# Altium schematic sheet isg_adc_dac_test_board_top.SchDoc
size C; SheetNumber: 1; SheetTotal: 1
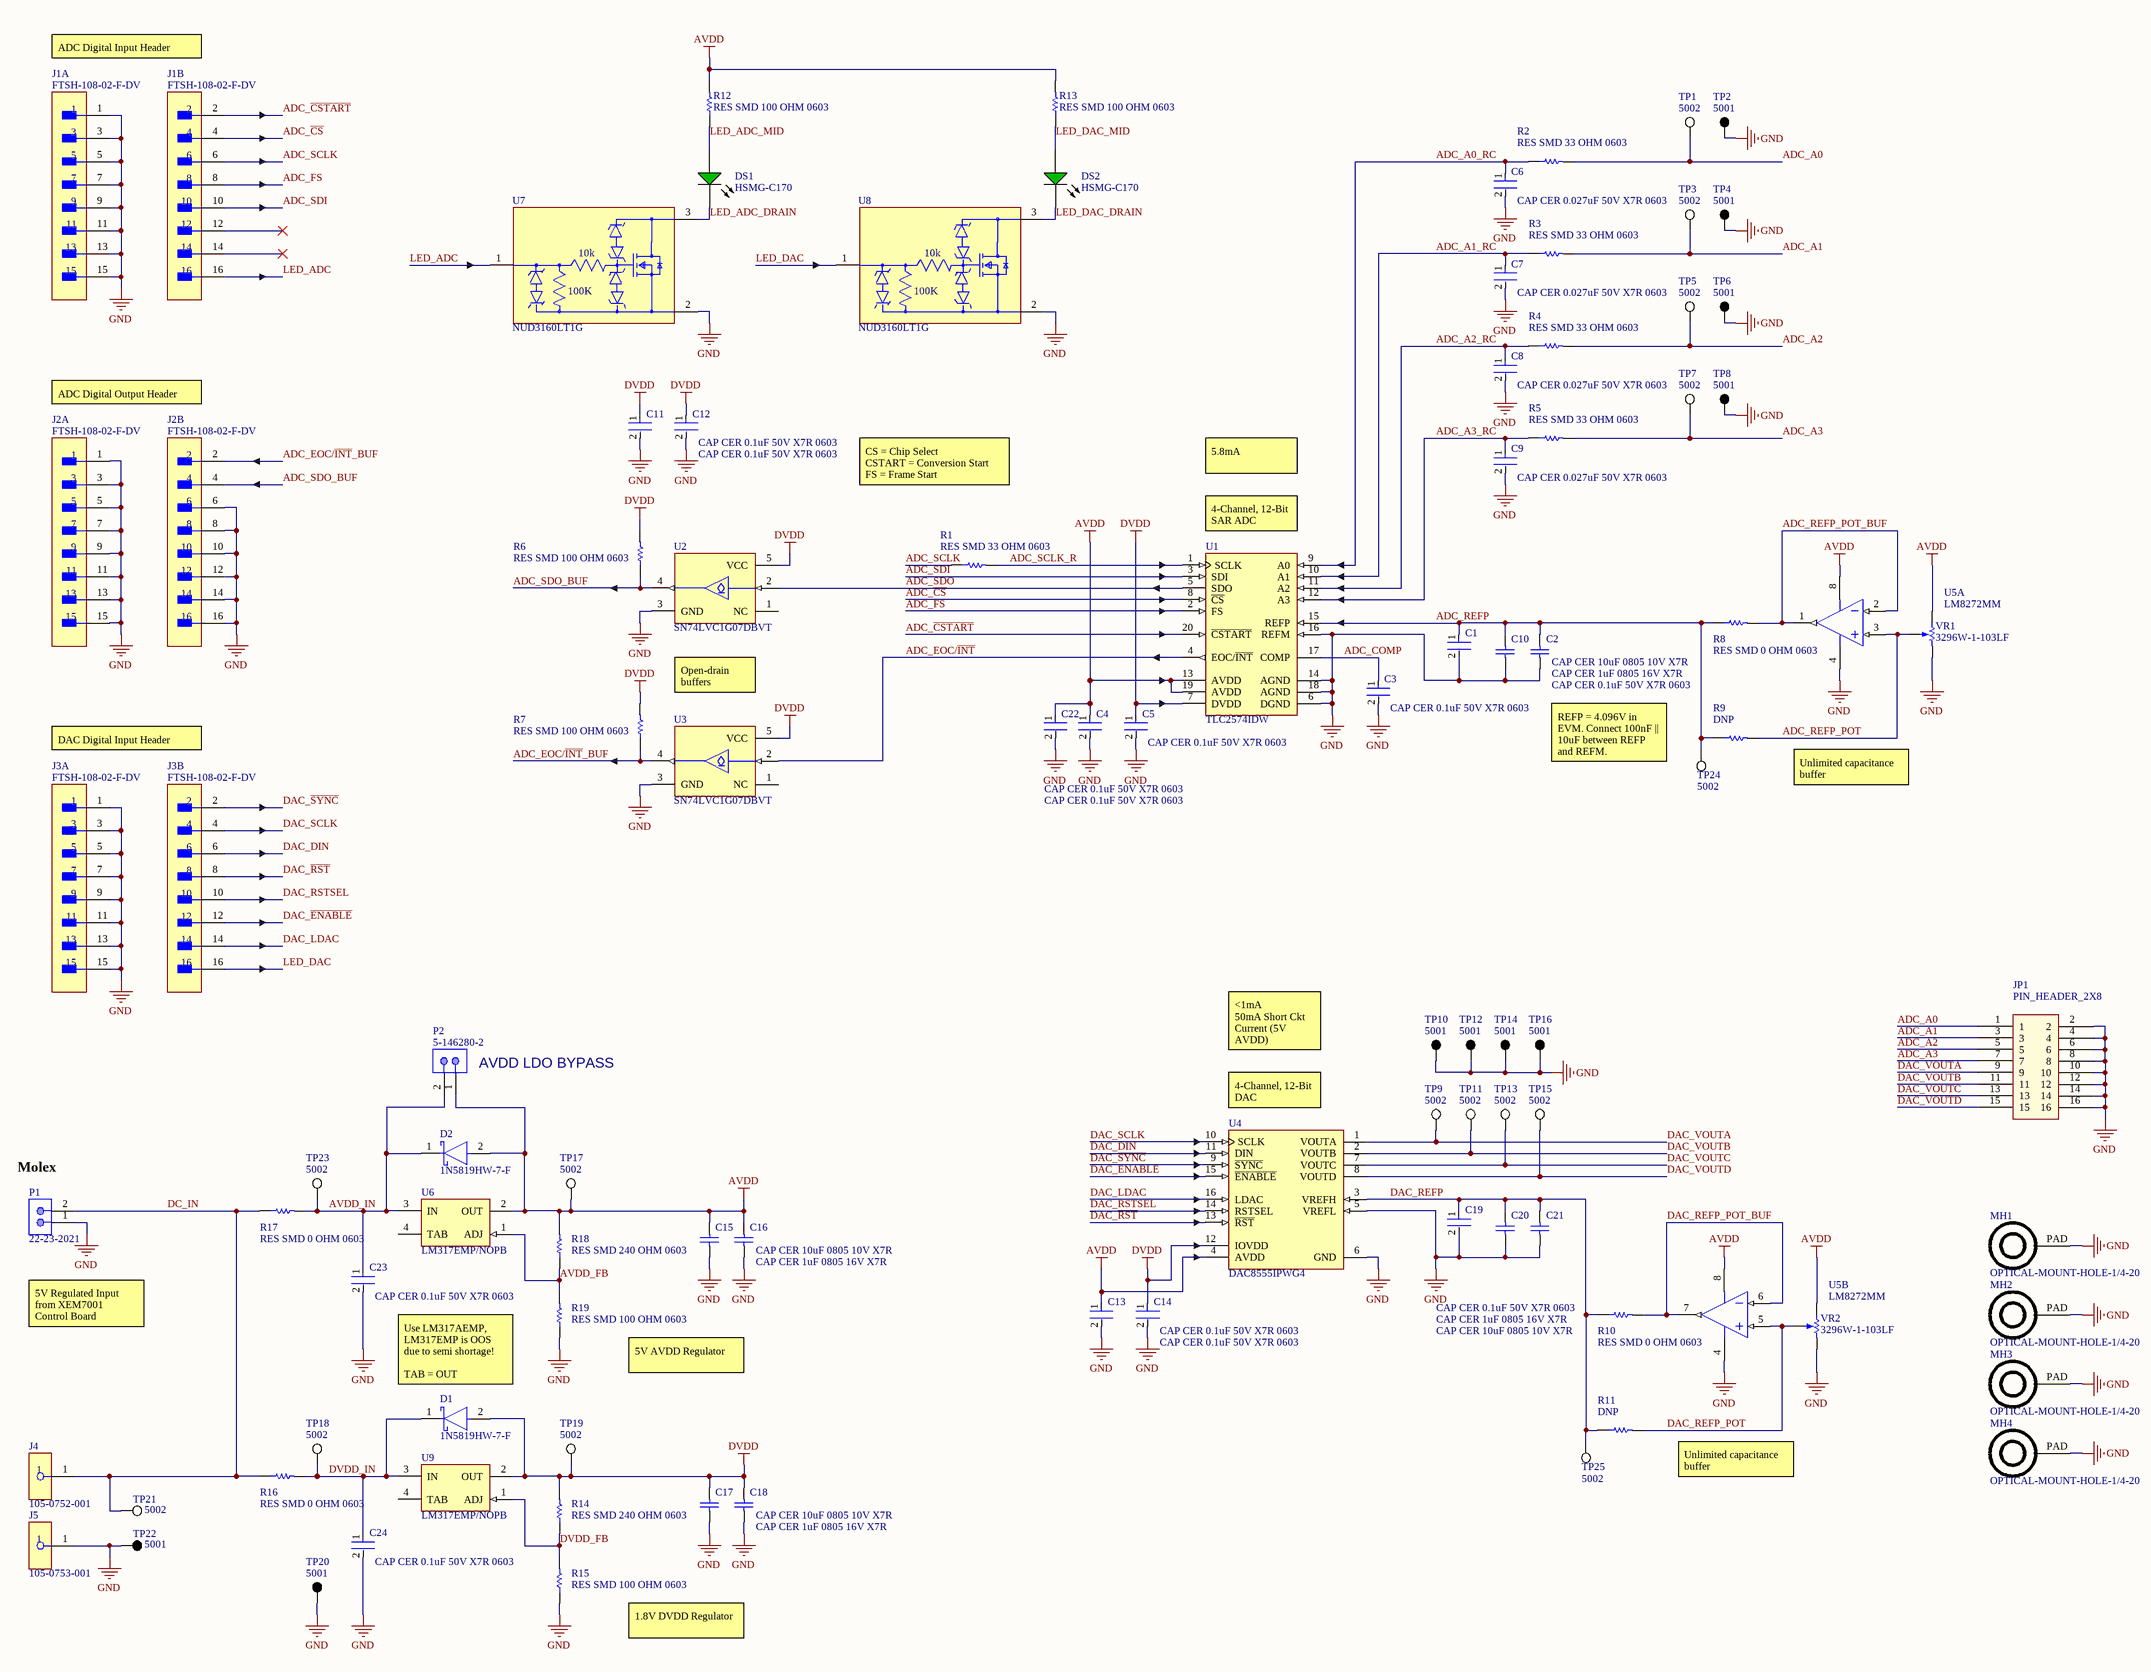
[diagram p0: isg_adc_dac_test_board_top.SchDoc]

## Parts
C1  CAP CER 0.1uF 50V X7R 0603  [FP-CC0603-DA-MFG]
C2  CAP CER 10uF 0805 10V X7R  [CAPC2013X140X50NL20T25]
C3  CAP CER 0.1uF 50V X7R 0603  [FP-CC0603-DA-MFG]
C4  CAP CER 0.1uF 50V X7R 0603  [FP-CC0603-DA-MFG]
C5  CAP CER 0.1uF 50V X7R 0603  [FP-CC0603-DA-MFG]
C6  CAP CER 0.027uF 50V X7R 0603  [FP-CC0603-DA-MFG]
C7  CAP CER 0.027uF 50V X7R 0603  [FP-CC0603-DA-MFG]
C8  CAP CER 0.027uF 50V X7R 0603  [FP-CC0603-DA-MFG]
C9  CAP CER 0.027uF 50V X7R 0603  [FP-CC0603-DA-MFG]
C10  CAP CER 1uF 0805 16V X7R  [CAPC2013X140X50NL20T25]
C11  CAP CER 0.1uF 50V X7R 0603  [FP-CC0603-DA-MFG]
C12  CAP CER 0.1uF 50V X7R 0603  [FP-CC0603-DA-MFG]
C13  CAP CER 0.1uF 50V X7R 0603  [FP-CC0603-DA-MFG]
C14  CAP CER 0.1uF 50V X7R 0603  [FP-CC0603-DA-MFG]
C15  CAP CER 1uF 0805 16V X7R  [CAPC2013X140X50NL20T25]
C16  CAP CER 10uF 0805 10V X7R  [CAPC2013X140X50NL20T25]
C17  CAP CER 1uF 0805 16V X7R  [CAPC2013X140X50NL20T25]
C18  CAP CER 10uF 0805 10V X7R  [CAPC2013X140X50NL20T25]
C19  CAP CER 0.1uF 50V X7R 0603  [FP-CC0603-DA-MFG]
C20  CAP CER 1uF 0805 16V X7R  [CAPC2013X140X50NL20T25]
C21  CAP CER 10uF 0805 10V X7R  [CAPC2013X140X50NL20T25]
C22  CAP CER 0.1uF 50V X7R 0603  [FP-CC0603-DA-MFG]
C23  CAP CER 0.1uF 50V X7R 0603  [FP-CC0603-DA-MFG]
C24  CAP CER 0.1uF 50V X7R 0603  [FP-CC0603-DA-MFG]
D1  1N5819HW-7-F  [FP-SOD123-IPC_A]
D2  1N5819HW-7-F  [FP-SOD123-IPC_A]
DS1  HSMG-C170  [AVAG-HSMX-C170_V]
DS2  HSMG-C170  [AVAG-HSMX-C170_V]
J1  FTSH-108-02-F-DV  [FP-FTSH-108-02-F-DV-MFG]  (parts A,B of 2)
J2  FTSH-108-02-F-DV  [FP-FTSH-108-02-F-DV-MFG]  (parts A,B of 2)
J3  FTSH-108-02-F-DV  [FP-FTSH-108-02-F-DV-MFG]  (parts A,B of 2)
J4  105-0752-001  [FP-105-0751-001-MFG]
J5  105-0753-001  [FP-105-0751-001-MFG]
JP1  PIN_HEADER_2X8  [PIN_HEADER_2X8_2.54MM]
MH1  OPTICAL-MOUNT-HOLE-1/4-20  [MH-1/4-20]
MH2  OPTICAL-MOUNT-HOLE-1/4-20  [MH-1/4-20]
MH3  OPTICAL-MOUNT-HOLE-1/4-20  [MH-1/4-20]
MH4  OPTICAL-MOUNT-HOLE-1/4-20  [MH-1/4-20]
P1  22-23-2021  [MOLX-22-23-2021_V]
P2  5-146280-2  [TECO-5-146280-2_V]
R1  RES SMD 33 OHM 0603  [RESC1609X50X30LL10T20]
R2  RES SMD 33 OHM 0603  [RESC1609X50X30LL10T20]
R3  RES SMD 33 OHM 0603  [RESC1609X50X30LL10T20]
R4  RES SMD 33 OHM 0603  [RESC1609X50X30LL10T20]
R5  RES SMD 33 OHM 0603  [RESC1609X50X30LL10T20]
R6  RES SMD 100 OHM 0603  [RESC1609X50X30LL10T20]
R7  RES SMD 100 OHM 0603  [RESC1609X50X30LL10T20]
R8  RES SMD 0 OHM 0603  [RESC1609X50X30LL10T20]
R9  DNP  [RESC1609X50X30LL10T20]
R10  RES SMD 0 OHM 0603  [RESC1609X50X30LL10T20]
R11  DNP  [RESC1609X50X30LL10T20]
R12  RES SMD 100 OHM 0603  [RESC1609X50X30LL10T20]
R13  RES SMD 100 OHM 0603  [RESC1609X50X30LL10T20]
R14  RES SMD 240 OHM 0603  [RESC1609X50X30LL10T20]
R15  RES SMD 100 OHM 0603  [RESC1609X50X30LL10T20]
R16  RES SMD 0 OHM 0603  [RESC1609X50X30LL10T20]
R17  RES SMD 0 OHM 0603  [RESC1609X50X30LL10T20]
R18  RES SMD 240 OHM 0603  [RESC1609X50X30LL10T20]
R19  RES SMD 100 OHM 0603  [RESC1609X50X30LL10T20]
TP1  5002  [KSTN-5002]
TP2  5001  [KSTN-5001]
TP3  5002  [KSTN-5002]
TP4  5001  [KSTN-5001]
TP5  5002  [KSTN-5002]
TP6  5001  [KSTN-5001]
TP7  5002  [KSTN-5002]
TP8  5001  [KSTN-5001]
TP9  5002  [KSTN-5002]
TP10  5001  [KSTN-5001]
TP11  5002  [KSTN-5002]
TP12  5001  [KSTN-5001]
TP13  5002  [KSTN-5002]
TP14  5001  [KSTN-5001]
TP15  5002  [KSTN-5002]
TP16  5001  [KSTN-5001]
TP17  5002  [KSTN-5002]
TP18  5002  [KSTN-5002]
TP19  5002  [KSTN-5002]
TP20  5001  [KSTN-5001]
TP21  5002  [KSTN-5002]
TP22  5001  [KSTN-5001]
TP23  5002  [KSTN-5002]
TP24  5002  [KSTN-5002]
TP25  5002  [KSTN-5002]
U1  TLC2574IDW  [TI-DW20_L]
U2  SN74LVC1G07DBVT  [FP-DBV0005A-MFG]
U3  SN74LVC1G07DBVT  [FP-DBV0005A-MFG]
U4  DAC8555IPWG4  [TI-PW16_L]
U5  LM8272MM  [DGK0008A_L]  (parts A,B of 2)
U6  LM317EMP/NOPB  [DCY0004A_L]
U7  NUD3160LT1G  [FP-318-08-MFG]
U8  NUD3160LT1G  [FP-318-08-MFG]
U9  LM317EMP/NOPB  [DCY0004A_L]
VR1  3296W-1-103LF  [BOUR-3296W]
VR2  3296W-1-103LF  [BOUR-3296W]

## Nets
AVDD: C4.1 C13.1 C15.1 C16.1 C22.1 D2.2(A) P2.1 R12.2 R13.2 R18.2 TP17.1 U1.13(AVDD) U1.19(AVDD) U4.4(AVDD) U5.8(V+) U6.2(OUT) VR1.1(CCW) VR2.1(CCW)
DVDD: C5.1 C11.1 C12.1 C14.1 C17.1 C18.1 D1.2(A) R6.2 R7.2 R14.2 TP19.1 U1.7(DVDD) U2.5(VCC) U3.5(VCC) U4.12(IOVDD) U9.2(OUT)
GND: C1.2 C2.2 C3.2 C4.2 C5.2 C6.2 C7.2 C8.2 C9.2 C10.2 C11.2 C12.2 C13.2 C14.2 C15.2 C16.2 C17.2 C18.2 C19.2 C20.2 C21.2 C22.2 C23.2 C24.2 J1.1 J1.3 J1.5 J1.7 J1.9 J1.11 J1.13 J1.15 J2.1 J2.3 J2.5 J2.6 J2.7 J2.8 J2.9 J2.10 J2.11 J2.12 J2.13 J2.14 J2.15 J2.16 J3.1 J3.3 J3.5 J3.7 J3.9 J3.11 J3.13 J3.15 J5.1 JP1.2 JP1.4 JP1.6 JP1.8 JP1.10 JP1.12 JP1.14 JP1.16 MH1.PAD MH2.PAD MH3.PAD MH4.PAD P1.1 R15.1 R19.1 TP2.1 TP4.1 TP6.1 TP8.1 TP10.1 TP12.1 TP14.1 TP16.1 TP20.1 TP22.1 U1.6(DGND) U1.14(AGND) U1.16(REFM) U1.18(AGND) U2.3(GND) U3.3(GND) U4.5(VREFL) U4.6(GND) U5.4(V-) U7.2(Source) U8.2(Source) VR1.3(CW) VR2.3(CW)
ADC_A0: JP1.1 R2.2 TP1.1
ADC_A0_RC: C6.1 R2.1 U1.9(A0)
ADC_A1: JP1.3 R3.2 TP3.1
ADC_A1_RC: C7.1 R3.1 U1.10(A1)
ADC_A2: JP1.5 R4.2 TP5.1
ADC_A2_RC: C8.1 R4.1 U1.11(A2)
ADC_A3: JP1.7 R5.2 TP7.1
ADC_A3_RC: C9.1 R5.1 U1.12(A3)
ADC_~{CS}: J1.4 U1.8(~{CS})
ADC_~{CSTART}: J1.2 U1.20(~{CSTART})
ADC_COMP: C3.1 U1.17(COMP)
ADC_EOC/~{INT}: U1.4(EOC/~{INT}) U3.2(A)
ADC_EOC/~{INT}_BUF: J2.2 R7.1 U3.4(Y)
ADC_FS: J1.8 U1.2(FS)
ADC_REFP: C1.1 C2.1 C10.1 R8.1 R9.1 TP24.1 U1.15(REFP)
ADC_REFP_POT: R9.2 U5.3(INA+) VR1.2(S)
ADC_REFP_POT_BUF: R8.2 U5.1(OUTA) U5.2(INA-)
ADC_SCLK: J1.6 R1.1
ADC_SCLK_R: R1.2 U1.1(SCLK)
ADC_SDI: J1.10 U1.3(SDI)
ADC_SDO: U1.5(SDO) U2.2(A)
ADC_SDO_BUF: J2.4 R6.1 U2.4(Y)
AVDD_FB: R18.1 R19.2 U6.1(ADJ)
AVDD_IN: C23.1 D2.1(C) P2.2 R17.2 TP23.1 U6.3(IN)
DAC_DIN: J3.6 U4.11(DIN)
DAC_~{ENABLE}: J3.12 U4.15(~{ENABLE})
DAC_LDAC: J3.14 U4.16(LDAC)
DAC_~{RST}: J3.8 U4.13(~{RST})
DAC_REFP: C19.1 C20.1 C21.1 R10.1 R11.1 TP25.1 U4.3(VREFH)
DAC_REFP_POT: R11.2 U5.5(INB+) VR2.2(S)
DAC_REFP_POT_BUF: R10.2 U5.6(INB-) U5.7(OUTB)
DAC_RSTSEL: J3.10 U4.14(RSTSEL)
DAC_~{SYNC}: J3.2 U4.9(~{SYNC})
DAC_SCLK: J3.4 U4.10(SCLK)
DAC_VOUTA: JP1.9 TP9.1 U4.1(VOUTA)
DAC_VOUTB: JP1.11 TP11.1 U4.2(VOUTB)
DAC_VOUTC: JP1.13 TP13.1 U4.7(VOUTC)
DAC_VOUTD: JP1.15 TP15.1 U4.8(VOUTD)
DC_IN: J4.1 P1.2 R16.1 R17.1 TP21.1
DVDD_FB: R14.1 R15.2 U9.1(ADJ)
DVDD_IN: C24.1 D1.1(C) R16.2 TP18.1 U9.3(IN)
LED_ADC: J1.16 U7.1(Gate)
LED_ADC_DRAIN: DS1.2(K) U7.3(Drain)
LED_ADC_MID: DS1.1(A) R12.1
LED_DAC: J3.16 U8.1(Gate)
LED_DAC_DRAIN: DS2.2(K) U8.3(Drain)
LED_DAC_MID: DS2.1(A) R13.1

Not connected (* = marked no-connect by the designer): J1 12* 14*; U2 1(NC); U3 1(NC); U6 4(TAB); U9 4(TAB)

## Notes on the sheet
- ADC Digital Input Header
- ADC Digital Output Header
- CS = Chip Select
  CSTART = Conversion Start
  FS = Frame Start
- 5.8mA
- (near U1) 4-Channel, 12-Bit SAR ADC
- Open-drain buffers
- DAC Digital Input Header
- REFP = 4.096V in EVM. Connect 100nF || 10uF between REFP and REFM.
- Unlimited capacitance buffer
- (near P2) AVDD LDO BYPASS
- <1mA
  50mA Short Ckt Current (5V AVDD)
- (near U4) 4-Channel, 12-Bit DAC
- (near P1) Molex
- 5V Regulated Input from XEM7001 Control Board
- Use LM317AEMP, LM317EMP is OOS due to semi shortage!
  TAB = OUT
- 5V AVDD Regulator
- 1.8V DVDD Regulator
- (in symbol CMP-07123-000002-1) 10k; 100K

## Library data of the parts
C1 C3-C9 C11-C14 C19 C22-C24 = CMP-03422-000030-1: Manufacturer Part Number: CC0603KRX7R7BB104; Manufacturer: YAGEO; Voltage Rating: 16 V; Tolerance: 0.1; Value: 100 nF; Temperature Coefficient: 15%; Material: Ceramic; Package: CC0603-DA; ComponentLink2Description: Datasheet; Octopart: https://octopart.com/cc0603krx7r7bb104-yageo-192941; Temperature Range High: +125°C; Digikey Description: CAP CER 0.1UF 16V X7R 0603; Voltage: 16 V; Device Class L2: Capacitors; Height: 0.9mm; Temperature: -55°C to +125°C; Device Class L1: Passive Components; Device Class L3: Ceramic Capacitors; ComponentLink2URL: http://www.yageo.com/documents/recent/UPY-GPHC_X7R_6.3V-to-50V_18.pdf; Footprint Url: http://www.yageo.com/exep/pages/download/literatures/UPY-C_GEN_24.pdf; RoHS: TRUE; Temperature Range Low: -55°C; Temperature Characteristic: X7R; Lead Free: Yes; Capacitance: 100 nF; Category: Cap; Mouser Description: Multilayer Ceramic Capacitor, CC Series, 0.1 - F, - 10%, X7R, 16 V, 0603 [1608 Metric]; Automotive: No
C2 C10 C15-C18 C20 C21 = CMP-2007-04677-1: Part Number: 0805ZC475KAT2A; Manufacturer: AVX Interconnect / Elco
D1 D2 = CMP-0303-00003-3: DIODE SCHOTTKY 40V 1A SOD123; Forward Voltage: 450mV; Capacitance: 110pF; Max Forward Surge Current (Ifsm): 25A; Peak Reverse Current: 50uA; Polarity: Standard; Element Configuration: Single; Max Power Dissipation: 450mW; Min Operating Temperature: -65°C; Package Quantity: 3000; Contact Plating: Tin; Weight: 0.000353oz; Max Repetitive Reverse Voltage (Vrrm): 40V; Max Reverse Voltage (DC): 40V; Height: 1.25mm; Average Rectified Current: 1A; Width: 1.7mm; Case/Package: SOD-123-2; Lead Free: Lead Free; Max Operating Temperature: 125°C; Current Rating: 1A; Termination: SMD/SMT; Forward Current: 1A; Radiation Hardening: No; Number of Pins: 2; Length: 2.85mm; Voltage Rating (DC): 40V; REACH SVHC: No SVHC; Peak Non-Repetitive Surge Current: 25A; Packaging: Tape and Reel; Output Current: 1A
DS1 DS2 = CMP-2000-05062-1: Chip LED, Green, 2.2 V, -40 to 85 degC, 2-Pin SMD, Pb-Free, Tape and Reel; Manufacturer: Avago; No. of Pins: 2; Peak Wavelength: 570nm; SVHC: NoSVHC(16-Jun-2014); Dominant Wavelength: 572nm; Forward Current If: 20mA; Viewing Angle: 170deg; Lens Shape: Rectangular; PIV Max: 5V; External Width: 1.25mm; LED Type: Standard; External Depth: 0.8mm; Opto Mounting Orientation: Top; Luminous Intensity: 15mcd; Luminous Intensity Min: 4mcd; Forward Voltage VF Max: 2.6V; External Length / Height: 2mm; Bulb Size: 1.25mmx1.4mm; Light Area Height: 1mm; Voltage Vf Typ: 2.2V; Operating Temperature Max: 85degC; Datasheet Version: Oct-08; MSL: MSL2A-4weeks; Peak Forward Current: 20mA; Package Description: 2-Pin Surface Mount Device, Body 2 x 1.25 mm, Height 0.8 mm; Datasheet URL: https://datasheet.ciiva.com/29280/180495-da-01-en-chip-led-hsmg-c170-gelb-gruen-29280971.pdf; Storage Temperature Min: -40degC; LED Colour: Green; Wavelength Typ: 570nm; Mounting Type: SMD; Forward Current If Max: 20mA; Dominant Wavelength Typ: 572nm; LED Mounting: SMD; Operating Temperature Range: -30degCto+85degC; Operating Temperature Min: -30degC; Manufacturer URL: http://www.avagotech.com/; Packaging: CutTape; Luminous Intensity Typ: 15mcd; Package Reference: HSMX-C170; Storage Temperature Max: 85degC; Opto Case Style: SMD; Forward Voltage: 2.2V
J1-J3 = CMP-02766-000080-1: CONN HEADER SMD 16POS 1.27MM; Manufacturer: Samtec; Standoff Height: 0.46mm; Conn Orientation: Vertical; Current Rating: 3.4A; Number Of Contacts: 16; Conn Gender: Male; Lead Free: Yes; Package: FTSH-108-02-F-DV; Footprint Url: http://suddendocs.samtec.com/prints/ftsh-1xx-xx-xxx-dv-xxx-footprint.pdf; Automotive: No; Pitch: 1.27mm; Manufacturer Part Number: FTSH-108-02-F-DV; Device Class L2: Headers and Wire Housings; ComponentLink2URL: http://suddendocs.samtec.com/prints/ftsh-1xx-xx-xxx-dv-xxx-xxx-mkt.pdf; ComponentLink2Description: Datasheet; Octopart: https://octopart.com/ftsh-108-02-f-dv-samtec-10605893; RoHS: TRUE; Digikey Description: CONN HEADER SMD 16POS 1.27MM; Device Class L1: Connectors; Temperature Range High: +125°C; Temperature: -55°C to +125°C; Device Class L3: unset; Category: Conn; Temperature Range Low: -55°C; Number Of Rows: 2; Contact Material: Gold,Nickel; Mouser Description: Conn Unshrouded Header HDR 16 POS 1.27mm Solder ST SMD Tube; Height: 5.09mm
J4 J5 = CMP-09586-000001-1: CONN TIP JACK SOLDER WHITE; Manufacturer: Cinch Connectivity; Manufacturer Part Number: 105-0751-001; Current Rating: 5A; Number Of Contacts: 1; Conn Orientation: Horizontal; Pitch: 10.16mm; Voltage Rating: 1500V; Is Female: yes; ComponentLink2URL: https://belfuse.com/resources/Johnson/drawings/dr-1050751001.pdf; RoHS: TRUE; ComponentLink2Description: Datasheet; Automotive: No; Temperature Range Low: -55°C; Digikey Description: CONN TIP JACK SOLDER WHITE; Device Class L2: unset; Octopart: https://octopart.com/105-0751-001-cinch+connectivity+solutions-51372833; Lead Free: Yes; Package: 105-0751-001; Device Class L3: unset; Contact Material: Silver; Temperature Range High: +75°C; Device Class L1: Connectors; Category: Conn; Height: 0.213inch; Temperature: -55°C to +75°C
P1 = CMP-1704-00001-3: Male Header, Pitch 2.54 mm, 1 x 2 Position, Height 10.67 mm, Tail Length 3.56 mm, 0 to 75 degC, RoHS, Bulk; Package Quantity: 3000; Height: 10.67 mm; RoHSCompliant: True; ComponentLink2URL: https://datasheet.ciiva.com/19454/232266-19454304.pdf; PartNumber: 22-23-2021; Packaging: Bulk; ComponentLink2Description: Datasheet; Min Operating Temperature: 0 degC; ComponentLink1Description: Manufacturer URL; Length: 5.08 mm; Mounting Technology: Through Hole; Max Operating Temperature: 75 degC; REACH SVHC: Unknown; PackageDescription: Male Header, Pitch 2.54 mm, 1 x 2 Position, Height 10.67 mm, Tail Length 3.56 mm; ComponentLink1URL: http://www.molex.com/; Mount: Through Hole; Radiation Hardening: No; Width: 6.35 mm; Pins: 2
P2 = CMP-2000-07492-1: Male Header, Pitch 2.54 mm, 1 x 2 Position, Height 8.21 mm, Tail Length 3.05 mm, -65 to 105 degC, RoHS, Bulk; Manufacturer: TE Connectivity; Mating Connector Lock: No(Without); Number of Positions: 2; Pitch: 2.54mm; PCB Mounting Orientation: Vertical; Keyed: No; Case\/Package: 100; Mating Post Length: 0.23inch; High Temperature Housing: Yes; Max Current Rating: 5A; PCB Thickness: 0.063inch; PCB Mount Retention: Without; Approvals: CSA; Current Rating: 3A; Radiation Hardening: No; Length: 4.67mm; Contact Mating Length: 0.23inch; Connector Type: Header; Number of Rows: 1; Termination Post Length: 0.12inch; Board Standoff: No(Without); Max Operating Temperature: 105degC; Contact Shape: Square; Selectively Loaded: No(Without); Gasket: No(Without); Number of Contacts: 2; Contact Gender: Male; Mating Alignment: No(Without); Manufacturer URL: http://www.te.com/; Datasheet URL: http://www.te.com/commerce/DocumentDelivery/DDEController?Action=showdoc&DocId=Customer+Drawing%7F146280%7FH1%7Fpdf%7FEnglish%7FENG_CD_146280_H1.pdf%7F5-146280-2; Mount: ThroughHole; Orientation: Straight; Packaging: Carton; Package Reference: 5-146280-2; Package Quantity: 500; Stabilizers: No(Without); Row Spacing: 2.54mm; Contact Material: CopperAlloy; Panel Mount Retention: No(Without); Datasheet Version: Rev. H1, 08/2016; Housing Colour: Black; Colour: Black; Package Description: Male Header, Pitch 2.54 mm, 1 x 2 Position, Height 8.21 mm, Tail Length 3.05 mm; Contact Plating: Matte; Housing Material: Polymer; Contact Protection: No(Without); Min Operating Temperature: -65degC; Mounting Technology: ThroughHole; Flammability Rating: UL94V-0; RoHSCompliant: true; Termination: ThroughHole; Depth: 2.34mm; High Speed Serial Data Connector: No
R1-R19 = CMP-2000-03820-1: Part Number: CRCW0603100KFKEA; Manufacturer: Vishay Dale
TP1 TP3 TP5 TP7 TP9 TP11 TP13 TP15 TP17-TP19 TP21 TP23-TP25 = CMP-2000-05182-1: Test Point, White, 1-Pin THD, RoHS, Bulk; Manufacturer: KeystoneElectronics; Outside Diameter: 2.54mm; Plating: Silver; Mounting Hole Size: 1mm; Product: TestPoints; Packaging: Bulk; Manufacturer URL: http://www.keyelco.com/; Length: 7.62mm; Datasheet Version: Rev. G, 12/2008; Type: Miniature; Product Category: CircuitBoardHardware-PCB; Material: Nylon; RoHS: True; Contact Material: PhosphorBronze; Datasheet URL: https://ciiva.com/datasheet-click-2917627?src=ciiva&sig=bd195616; Color: White; Brand: KeystoneElectronics
TP2 TP4 TP6 TP8 TP10 TP12 TP14 TP16 TP20 TP22 = CMP-2000-05181-1: Test Point, Black, 1-Pin THD, RoHS, Bulk; Manufacturer: Keystone; Other Names: 5001K; Catalog Drawings: 5000Series; Alternate Color: 5004K-ND / -TESTPOINTPCMINI.040"DYELLOW / 5003K-ND / -TESTPOINTPCMINI.040"DORANGE / 5002K-ND / -TESTPOINTPCMINI.040"DWHITE / 5000K-ND / -TESTPOINTPCMINI.040"DRED; Kits: DKTGRS232C-KIT-ND / -TTLCONVERTER; Online Catalog: ColorCodedTestPoints; Datasheet URL: https://ciiva.com/datasheet-click-2917627?src=ciiva&sig=bd195616; Mounting Type: 0.040"(1.02mm)HoleDiameter; Family: TestPoints; RoHS Information: RoHSComplianceStatement; Datasheet Version: Rev. G, 12/2008; Color: Black; Category: TestandMeasurement; Standard Package: 100; Manufacturer URL: http://www.keyelco.com/; Material: Base,Nylon46,UL94V-0; Type: PCTestPoint,Miniature; Terminal: 0.010"x0.020"(0.25mmx0.51mm)PhosphorBronzeWire,SilverPlated; Series: THM; Packaging: Bulk
U1 = CMP-0003-01500-1: Serial Out, Low Power with Built-In Conversion Clock and 8 x FIFO, 4 Channel, -40 to 85 degC, 20-pin SOIC (DW20), Green (RoHS & no Sb/Br); Manufacturer: Texas Instruments; Resolution(Bits): 12; SubFamily: Precision ADC (<=10MSPS); Interface: Serial SPI; ENOB(Bits): 11.7; # Input Channels: 4; Analog Voltage AV/DD(Min)(V): 4.75; Digital Supply(Min)(V): 2.7; Analog Voltage AV/DD(Max)(V): 5.5; INL(Max)(+/-LSB): 1; Sample Rate (max)(SPS): 200K; Architecture: SAR; SINAD(dB): 72; SFDR(dB): 83; ComponentLink3Description: Package Specification; Mounting Technology: Surface Mount; ComponentLink1URL: http://www.ti.com/; ComponentLink3URL: http://www.ti.com/lit/ml/mpds173a/mpds173a.pdf; PartNumber: TLC2574IDW; ComponentLink2Description: Datasheet; PackageReference: DW20; Eco-Plan: Green (RoHS & no Sb/Br); ComponentLink2URL: http://www.ti.com/general/docs/lit/getliterature.tsp?genericPartNumber=TLC2574&fileType=pdf; PackageDescription: 20-Pin Plastic Small Outline, Body 12.8 x 7.5 mm, Pitch 1.27 mm; Code_JEDEC: MO-013; PackageVersion: 4040000-4/G, 01/2011; ComponentLink1Description: Manufacturer URL; Digital Supply(Max)(V): 5.5; SNR(dB): 72; DatasheetVersion: SLAS262C
U2 U3 = CMP-0859-00129-4: IC BUF NON-INVERT 5.5V SOT23-5; Manufacturer: Texas Instruments; Number Of Inputs: 1; Min Supply Voltage: 1.65V; Propagation Delay: 4ns; Max Junction Temp: +150°C; Standoff Height: 0mm; Nominal Supply Current: 10uA; Logic Function Desc: Non-Inverting; ComponentLink2URL: http://www.ti.com/lit/ds/symlink/sn74lvc1g07.pdf; Temperature: -40°C to +125°C; Package: DBV0005A; Temperature Range High: +125°C; Number Of Circuits: 1; Manufacturer Part Number: SN74LVC1G07DBVT; Height: 1.45mm; Automotive: No; Ambient Temperature Range High: +125°C; Device Class L2: Logic ICs; RoHS: TRUE; Device Class L1: Integrated Circuits (ICs); Mouser Description: Buffers & Line Drivers SNGL Buffer/Driver; Lead Free: Yes; Max Supply Voltage: 5.5V; Temperature Range Low: -40°C; Digikey Description: IC BUF NON-INVERT 5.5V SOT23-5; Number Of Outputs: 1; Octopart: https://octopart.com/sn74lvc1g07dbvt-texas+instruments-1006798; Ambient Temperature Range Low: -40°C; ComponentLink2Description: Datasheet; Device Class L3: Buffers; Category: IC
U4 = CMP-0004-01174-1: 16-Bit, Quad Channel, Ultralow Glitch, Voltage Output Digital to Analog Converter, -40 to 105 degC, 16-pin SOP (PW16), Green (RoHS & no Sb/Br); Manufacturer: Texas Instruments; SubFamily: Precision DAC (=<10MSPS); Resolution(Bits): 16; SNR(dB): 95; Interface: Serial SPI; SFDR(dB): 87; DAC Channels: 4; Settling Time(us): 10; DNL(Max)(+/-LSB): 1; ComponentLink2Description: Datasheet; PackageReference: PW16; PackageVersion: 4040064-4/G, 02/2011; ComponentLink3Description: Package Specification; Code_JEDEC: MO-153; Eco-Plan: Green (RoHS & no Sb/Br); Mounting Technology: Surface Mount; DatasheetVersion: SLAS475B; PackageDescription: 16-Pin Plastic Small Outline, Body 5 x 4.4 mm, Pitch 0.65 mm; ComponentLink1Description: Manufacturer URL; ComponentLink1URL: http://www.ti.com/; ComponentLink3URL: http://www.ti.com/lit/ml/mpds361/mpds361.pdf; PartNumber: DAC8555IPWG4; ComponentLink2URL: http://www.ti.com/general/docs/lit/getliterature.tsp?genericPartNumber=DAC8555&fileType=pdf
U5 = CMP-0055-01394-3: RRIO, High Output Current & Unlimited Cap Load Op Amp, 8-pin Mini SOIC; Manufacturer: Texas Instruments; CompType: Amplifiers; PowerWise: N; PackageTopMarking: ZXTT*A60; RoHS: N; ComponentLink1Description: Datasheet URL; PinCount: 8; Code_JEDEC: MO-187-AA; Package Reference: DGK0008A; ComponentLink1URL: http://www.ti.com/general/docs/lit/getliterature.tsp?genericPartNumber=LM8272&fileType=pdf; PackageDescription: MINI SOIC, .118 x .118 x .034in, 8 Lead, .0256in Pitch
U6 U9 = CMP-0062-01707-3: 3-Terminal Adjustable Regulator, 4-pin SOT-223, Pb-Free; Manufacturer: Texas Instruments; PowerWise: N; PackageTopMarking: XYTT*N01A; CompType: LDO IC; PackageDescription: Molded SOT-223, 6.50 x 3.56 x 1.6mm Body, 4 Lead, 2.3mm Pitch; Code_IPC: SOT223-4; ComponentLink1Description: Datasheet URL; Code_JEDEC: TO-261-AA; ComponentLink1URL: http://www.ti.com/general/docs/lit/getliterature.tsp?genericPartNumber=LM317-N&fileType=pdf; RoHS: Y; PinCount: 4; PackageReference: DCY0004A
U7 U8 = CMP-07123-000002-1: IC INDCT LOAD DRVR INDUST SOT23; Manufacturer: ON Semiconductor; Max Power Dissipation: 225mW; Fall Time: 622ns; Max Supply Voltage: 60V; Propagation Delay: 1160ns; Output Current: 150mA; Output Voltage: 48V; Standoff Height: 0.01mm; Number Of Outputs: 1; Max Junction Temp: +150°C; Rise Time: 600ns; Temperature Range Low: -40°C; Mouser Description: MOSFET 61V Industrial Load Driver; Ambient Temperature Range High: +125°C; Octopart: https://octopart.com/nud3160lt1g-on+semiconductor-470723; Package: 318-08; Automotive: No; Temperature: -40°C to +150°C; RoHS: TRUE; Lead Free: Yes; Height: 1.11mm; Device Class L3: Gate Drivers; Ambient Temperature Range Low: -40°C; Device Class L2: Power Management ICs; Digikey Description: IC INDCT LOAD DRVR INDUST SOT23; Category: IC; Device Class L1: Integrated Circuits (ICs); Manufacturer Part Number: NUD3160LT1G; Footprint Url: https://www.onsemi.com/pub/Collateral/318-08.PDF; Number Of Drivers: 1; ComponentLink2Description: Datasheet; Temperature Range High: +150°C; ComponentLink2URL: https://www.onsemi.com/pub/Collateral/NUD3160-D.PDF
VR1 VR2 = CMP-1747-00001-1: Square Trimpot(R) Trimming Potentiometer, 10 KOhm, +/- 10%, 0.5 W, -55 to 125 degC, 3-Pin THD, RoHS, Tube; Voltage Rating: 75 V; Resistance: 120 Ohm; Tolerance: 1%; Power Rating: 100 mW; Case\Package: 0603; Type (Resistor): Thick Film; PackageDescription: 3-Pin Through Hole Device, Body 9.53 x 4.83 mm, Pitch 2.54 mm; RoHSCompliant: true; Package Quantity: 5000; Case Code (Metric): 1608; PackageReference: 3296W; ComponentLink2Description: Datasheet; REACH SVHC: Unknown; Case Code (Imperial): 0603; ComponentLink1URL: http://www.bourns.com/; Width: 0.85 mm; Radiation Hardening: No; Min Operating Temperature: -55 degC; Mount: Surface Mount; ComponentLink1Description: Manufacturer URL; Max Operating Temperature: 155 degC; Weight: 7.1E-05 oz; Pins: 2; DatasheetVersion: May-16; Packaging: Tape and Reel; Height: 0.45 mm; Length: 1.55 mm; ComponentLink2URL: http://www.bourns.com/docs/Product-Datasheets/3296.pdf